# EAGLE design sc_v1 (EAGLE 9.6.2)
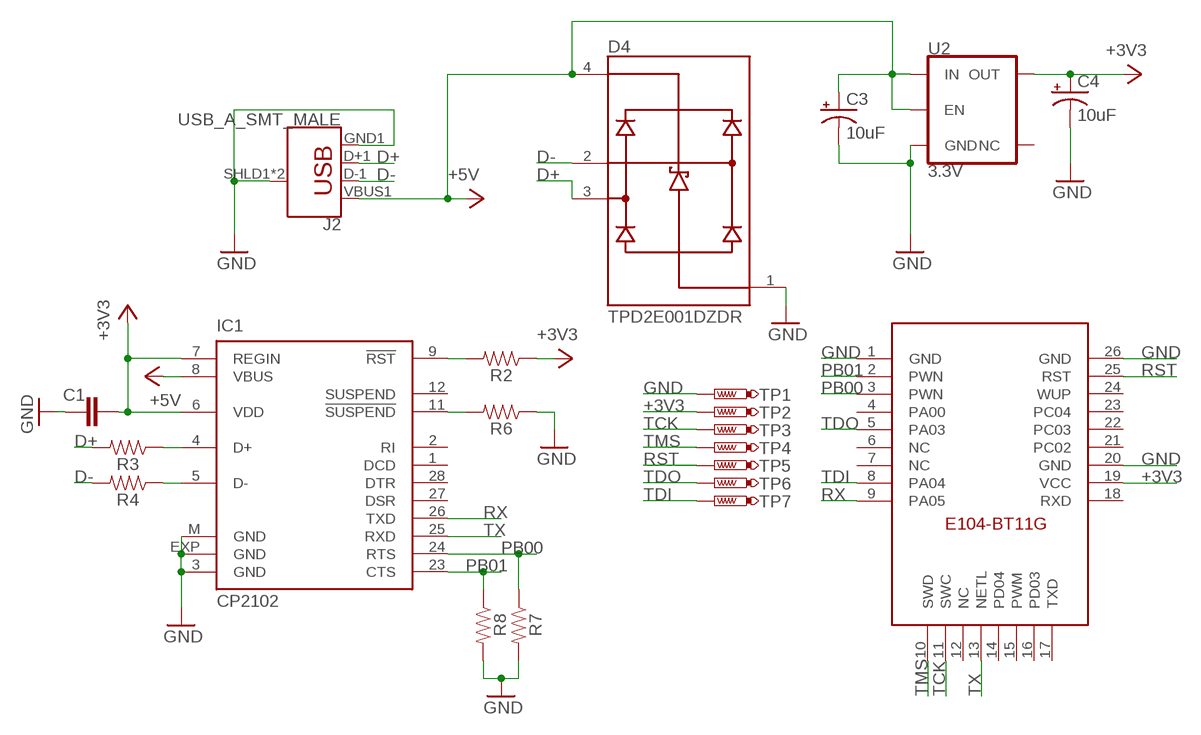
[diagram p0: schematic, sheet 1]

## Parts
C1  100nf  CAP0402  [CAPC1005X40N]
C3  10uF  10UF-POLAR-0603-6.3V-20%(TANT)  [0603-POLAR]
C4  10uF  10UF-POLAR-0603-6.3V-20%(TANT)  [0603-POLAR]
D4  TPD2E001DZDR  [SOT192P237X122-4N]
IC1  CP2102  [MLP28]
J2  USB_A_SMT_MALE  [USB-A-SMT-MALE]
R2  4.7k  RESISTOR0402  [0402]
R3  30Ohm  RESISTOR0402  [0402]
R4  30Ohm  RESISTOR0402  [0402]
R6  10k  RESISTOR0402  [0402]
R7  10k  RESISTOR0402  [0402]
R8  10k  RESISTOR0402  [0402]
TP1  PTR1TP10R  [TP10R]
TP2  PTR1TP10R  [TP10R]
TP3  PTR1TP10R  [TP10R]
TP4  PTR1TP10R  [TP10R]
TP5  PTR1TP10R  [TP10R]
TP6  PTR1TP10R  [TP10R]
TP7  PTR1TP10R  [TP10R]
U2  3.3V  V_REG_AP2112K-3.3V  [SOT23-5]
U$1  E104-BT11G-PCBPCB  [E104-BT11G-PCB]

## Nets
+3V3: C1.2 C4.+ IC1.6(VDD) IC1.7(REGIN) R2.1 TP2.TP U2.5(OUT) U$1.19(VCC)
+5V: C3.+ D4.4(VCC) IC1.8(VBUS) J2.VBUS1(VBUS) U2.1(IN) U2.3(EN)
D+: D4.3(IO2) J2.D+1(D+) R3.2
D-: D4.2(IO1) J2.D-1(D-) R4.2
GND: C1.1 C3.- C4.- D4.1(GND) IC1.3(GND) IC1.EXP(GND) IC1.M(GND) J2.GND1(GND) J2.SHLD1(SHIELD) J2.SHLD2(SHIELD) R6.1 R7.2 R8.2 TP1.TP U2.2(GND) U$1.1(GND) U$1.20(GND) U$1.26(GND)
N$1: IC1.4(D+) R3.1
N$2: IC1.5(D-) R4.1
N$3: IC1.9(!RST) R2.2
N$5: IC1.11(!SUSPEND) R6.2
PB00: IC1.24(RTS) R7.1 U$1.3(PWN)
PB01: IC1.23(CTS) R8.1 U$1.2(PWN)
RST: TP5.TP U$1.25(RST)
RX: IC1.26(TXD) U$1.9(PA05)
TCK: TP3.TP U$1.11(SWC)
TDI: TP7.TP U$1.8(PA04)
TDO: TP6.TP U$1.5(PA03)
TMS: TP4.TP U$1.10(SWD)
TX: IC1.25(RXD) U$1.13(NETL)
Unconnected: IC1.1(DCD) IC1.2(RI) IC1.12(SUSPEND) IC1.27(DSR) IC1.28(DTR) U2.4(NC) U$1.4(PA00) U$1.6(NC) U$1.7(NC) U$1.12(NC) U$1.14(PD04) U$1.15(PWM) U$1.16(PD03) U$1.17(TXD) U$1.18(RXD) U$1.21(PC02) U$1.22(PC03) U$1.23(PC04) U$1.24(WUP)

## Library data of the parts
C1 = discretes-dev:CAP0402: CAP, 0402; AVAILABILITY: Good; DESCRIPTION: RESISTOR, 0402 0.063W 1% 3M6; Resistance:3.6Mohm; Resistance Tolerance:± 1%; Power Rating:0.063W; Voltage Rating:50V; Series:RC32H; Temperature Coefficient:± 100ppm/°C; Resistor Element Type:Thick Film; Resistor Case Style:0402; No. of Pins:2; SVHC:No SVHC; Case Style:0402; External Length / Height:1mm; Temperature Coeff. +:100ppm/°C; Temperature Coeff. -:100ppm/°C; External Depth:0.35mm; External Width:0.5mm; Operating Temperature Range:-55°C to +155°C; Overload Voltage:100V; MF: Yageo; MP: RC0402FR-073M6L; PACKAGE: 1005 Panasonic Electronic Components; PRICE: None; PURCHASE-URL: https://pricing.snapeda.com/search/part/RC0402FR-073M6L/?ref=eda
C3 C4 = SparkFun-Capacitors:10UF-POLAR: 10.0µF polarized capacitors A capacitor is a passive two-terminal electrical component used to store electrical energy temporarily in an electric field.; PROD_ID: CAP-13210
D4 = TPD2E001DZDR:TPD2E001DZDR: Low-capacitance 2-channel +/-15k-V ESD protection array for high-speed data interfaces Check prices <https://pricing.snapeda.com/parts/TPD2E001DZDR/Texas%20Instruments/view-part?ref=eda>; AVAILABILITY: In Stock; DESCRIPTION: Low-capacitance 2-channel +/-15k-V ESD protection array for high-speed data interfaces 4-SOT-23 -40 to 85; MF: Texas Instruments; MP: TPD2E001DZDR; PACKAGE: SOT-23-4 Texas Instruments; PRICE: None; PURCHASE-URL: https://pricing.snapeda.com/search/part/TPD2E001DZDR/?ref=eda
IC1 = silabs:CP210*: Single-Chip USB to UART Bridge Source: www.silabs.com .. CP2101.pdf / cp2102.pdf; MF: FARNELL; MPN: CP2102-GM; OC_FARNELL: 9282130; OC_NEWARK: 30K5635
J2 = SparkFun-Connectors:USB_A: USB-A Connector Male and female variants, as well as PTH and SMT variants SparkFun Products: SparkFun XBee Explorer Dongle <https://www.sparkfun.com/products/11697> PTH Male SparkFun MicroView-USB Programmer <https://www.sparkfun.com/products/12924> SMT Male SparkFun USB Type A Female Breakout <https://www.sparkfun.com/products/12700> SMT Female; PROD_ID: CONN-11499
R2-R4 R6-R8 = SparkFun-Resistors:RESISTOR: Generic Resistor Package
TP1-TP7 = testpad:PTR1: TEST PIN
U2 = SparkFun-IC-Power:V_REG_AP2112: AP2112 - 600mA CMOS LDO Regulator w/ Enable The AP2112 is CMOS process low dropout linear regulator with enable function, the regulator delivers a guaranteed 600mA (min.) continuous load current. Features Output Voltage Accuracy: ±1.5% Output Current: 600mA (Min.) Foldback Short Current Protection: 50mA Enable Function to Turn ON/OFF VOUT Low Dropout Voltage (3.3V): 250mV (Typ.) @IOUT=600mA Excellent Load Regulation: 0.2%/A (Typ.) Excellent Line Regulation: 0.02%/V (Typ.) Low Quiescent Current: 55μA (Typ.) Low Standby Current: 0.01μA (Typ.) Low Output Noise: 50μVRMS PSRR: 100Hz -65dB, 1kHz -65dB OTSD Protection Stable with 1.0μF Flexible Cap: Ceramic, Tantalum and Aluminum Electrolytic Operation Temperature Range: -40°C to 85°C ESD: MM 400V, HBM 4000V; PROD_ID: VREG-12457
U$1 = E104-BT11G-PCB:E104-BT11G-PCB

## Board
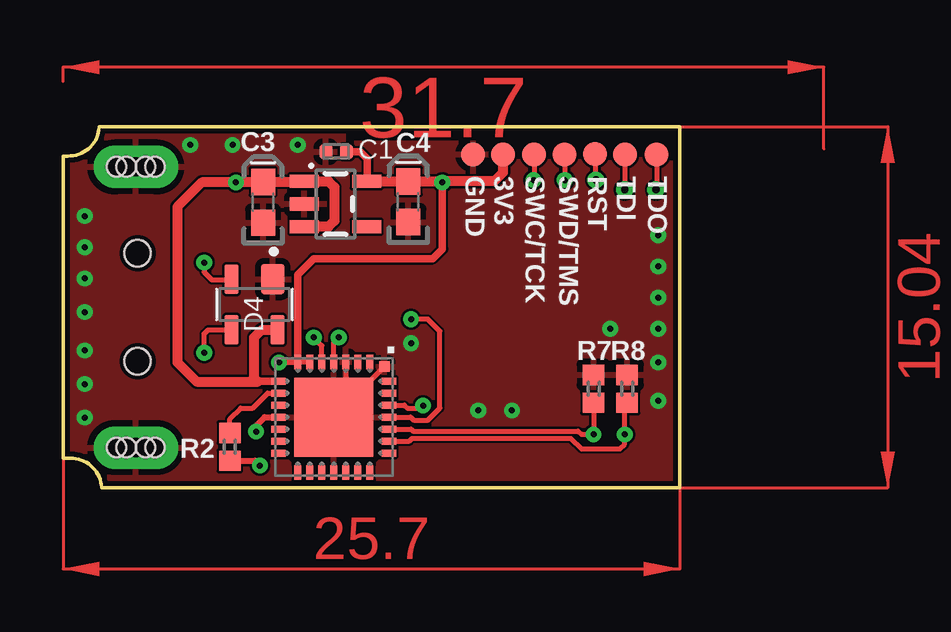
[diagram p1: board, top side]
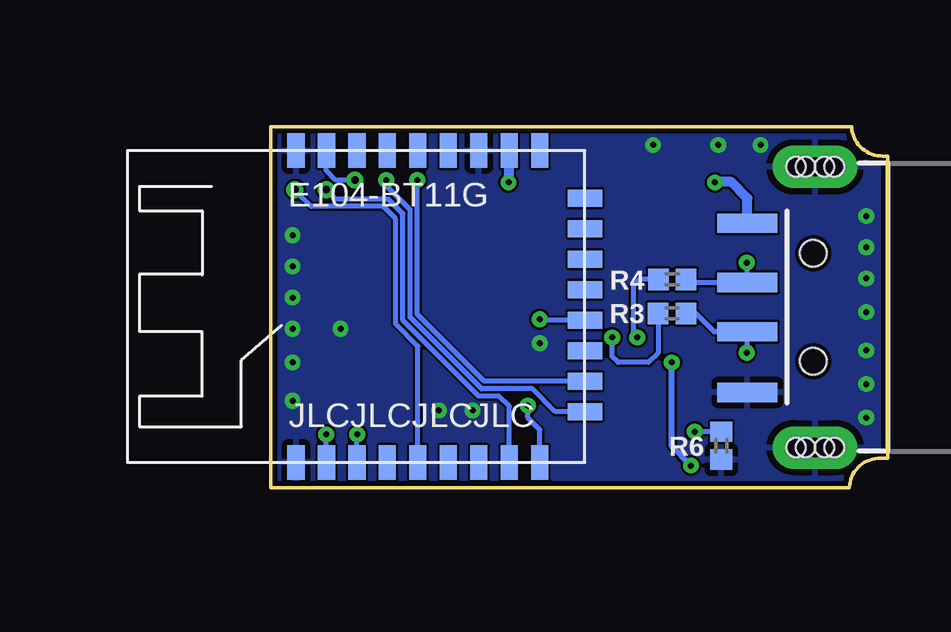
[diagram p2: board, bottom side, seen from below]

Size 25.7 x 15.04 mm. Coordinates in mm from the lower left corner, seen from the top.
Outline: 25.7,15.04 1.5,15.04 arc-90 0.2,13.82 0,13.82 0,1.22 0.3,1.22 arc-90 1.6,0 25.7,0 25.7,15.04
Copper layers (1*16): Top 0.035mm / dielectric 1.5mm / Bottom 0.035mm
Design rules "default": minimum track width 0.2mm, minimum drill 0.25mm, track to track 4mil, track to pad 4mil, pad to pad 4mil, via to via 4mil, smd to smd 4mil, copper to edge 0.2mm, drill to drill 0.25mm, minimum pad ring 10mil, minimum via ring 8mil, stop-mask expansion 2mil, vias tented up to drill 0.3mm, thermal gap 10mil

### Footprints (pad centres in the part's own frame; a part is rotated, then mirrored left to right if it is on the bottom)
CAPC1005X40N = smd 0.54 x 0.6: 1 -0.432,0; 2 0.432,0
0603-POLAR = smd 1.1 x 1: + 0.85,0; - -0.85,0
SOT192P237X122-4N = smd 1.24 x 0.99: 1 -1.055,0.76 | smd 1.24 x 0.59: 2 -1.055,-0.96; 3 1.055,-0.96; 4 1.055,0.96
MLP28 = smd 0.6 x 0.3: 1 -2.3,1.5; 2 -2.3,1; 3 -2.3,0.5; 4 -2.3,0; 5 -2.3,-0.5; 6 -2.3,-1; 7 -2.3,-1.5; 15 2.3,-1.5; 16 2.3,-1; 17 2.3,-0.5; 18 2.3,0; 19 2.3,0.5; 20 2.3,1; 21 2.3,1.5 | smd 0.3 x 0.6: 8 -1.5,-2.3; 9 -1,-2.3; 10 -0.5,-2.3; 11 0,-2.3; 12 0.5,-2.3; 13 1,-2.3; 14 1.5,-2.3; 22 1.5,2.3; 23 1,2.3; 24 0.5,2.3; 25 0,2.3; 26 -0.5,2.3; 27 -1,2.3; 28 -1.5,2.3 | smd 3.3 x 3.3: EXP 0,0 | smd 0.435 x 0.435: M -2.103,2.103
USB-A-SMT-MALE = smd 2.5 x 0.8: D+1 10.95,1.027; D-1 10.95,-1.027; GND1 10.95,3.551; VBUS1 10.95,-3.5 | drill 0.8 pad 1.778 long: SHLD1 8.13,-5.85; SHLD2 8.13,5.85 | hole 1.1: 8.2,2.25; 8.2,-2.25 | hole 0.8: 8.53,-5.85; 8.93,-5.85; 7.73,-5.85; 7.33,-5.85; 8.53,5.85; 8.93,5.85; 7.73,5.85; 7.33,5.85
0402 = smd 0.85 x 0.9: 1 -0.58,0; 2 0.58,0
TP10R = smd 1 x 1: TP 0,0
SOT23-5 = smd 0.55 x 1.2: 1 -0.95,-1.3; 2 0,-1.3; 3 0.95,-1.3; 4 0.95,1.3; 5 -0.95,1.3
E104-BT11G-PCB = smd 1.422 x 0.711: 1 -0.043,12.039; 2 -0.043,10.769; 3 -0.043,9.499; 4 -0.043,8.229; 5 -0.043,6.959; 6 -0.043,5.689; 7 -0.043,4.419; 8 -0.043,3.149; 9 -0.043,1.879; 18 12.954,1.879; 19 12.954,3.149; 20 12.954,4.419; 21 12.954,5.689; 22 12.954,6.959; 23 12.954,8.229; 24 12.954,9.499; 25 12.954,10.769; 26 12.954,12.039 | smd 0.711 x 1.422: 10 2.079,0; 11 3.349,0; 12 4.619,0; 13 5.889,0; 14 7.159,0; 15 8.429,0; 16 9.699,0; 17 10.969,0

### Placement (x,y rotation side)
C1  11.38,14 0 top
C3  8.33,11.89 90 top
C4  14.38,11.91 90 top
D4  7.97,7.64 270 top
IC1  11.28,2.94 270 top
J2  -5.1,7.52 180 bottom
R2  6.95,1.7 90 top
R3  8.99,7.26 0 bottom
R4  8.98,8.68 0 bottom
R6  6.94,1.75 90 bottom
R7  22.1,4.12 90 top
R8  23.5,4.12 90 top
TP1  17.09,13.89 0 top
TP2  18.34,13.89 0 top
TP3  19.62,13.88 0 top
TP4  20.9,13.89 0 top
TP5  22.16,13.89 0 top
TP6  24.73,13.89 0 top
TP7  23.41,13.89 0 top
U2  11.35,11.82 270 top
U$1  12.62,1.09 90 bottom

### Tracks (layer width: path | path; a pad name or v marks a point on that pad's centre or on a via)
+3V3  (via drill 0.25)
  Top 0.254: R2.1 8,1.12 v8.2,0.92 | IC1.6 IC1.7 9.76,5.22 v9,5.22
  Top 0.305: C1.2 12.38,14 12.68,13.7 12.68,12.8 U2.5 | IC1.7 9.78,8.88 10.44,9.54 15.4,9.54 15.8,9.94 v15.8,12.72
  Top 0.406: U2.5 C4.+ 15.76,12.76 v15.8,12.72 15.85,12.77 17.97,12.77 18.34,13.13 TP2.TP
  Bottom 0.254: 15.7,12.62 v15.8,12.72 | v8.2,0.92 9,1.72 v9,5.22
  Bottom 0.406: U$1.19 15.8,14.01 v15.8,12.72
+5V  (via drill 0.25)
  Top 0.254: D4.4 8.78,6.42
  Top 0.305: IC1.8 8.14,4.44 8.12,4.42
  Top 0.406: U2.3 11.05,10.87 11.3,11.12 11.3,12.52 11.05,12.77 U2.1 10.01,12.74 C3.+ 8.31,12.72 v7.2,12.72 5.78,12.72 4.76,11.7 4.76,5.22 5.56,4.42 7.8,4.42 | 7.8,4.42 8.12,4.42 | 7.8,4.42 7.96,4.58 7.96,6.26 8.28,6.58 D4.4
  Bottom 0.406: J2.VBUS1 5.85,12.07 6.52,12.74 7.18,12.74 v7.2,12.72
D+  (via drill 0.25)
  Top 0.2: v5.88,5.62 5.88,6.42 6.04,6.58 D4.3
  Bottom 0.2: v5.88,5.62 5.88,6.46 J2.D+1 7.23,6.49 8,7.26 R3.2
D-  (via drill 0.25)
  Top 0.2: v5.88,9.38 5.88,8.98 6.2,8.66 6.99,8.66 D4.2
  Bottom 0.2: v5.88,9.38 5.85,9.35 J2.D-1 8.27,8.55 R4.2
GND  (via drill 0.25)
  Top 0.2: IC1.3 11.78,3.44 | 11.78,3.44 IC1.EXP | IC1.M 11.78,3.44
  Top 0.305: 8.31,11.02 C3.- 8.3,11.07
  other vias: 22.8,6.62 24.8,10.52 17.3,3.22 18.7,3.22 14.5,6.02 0.9,11.32 0.9,10.02 0.9,8.72 0.9,7.32 0.9,5.72 0.9,4.32 0.9,2.92 24.8,9.22 24.8,7.92 24.8,6.62 24.8,5.22 24.8,3.62 5.3,14.28 7.06,14.28 9.78,14.28
  pour Bottom: -0.14,-0.18 26.09,-0.18 26.09,15.3 -0.14,15.3
  pour Top: -0.2,15.42 25.9,15.42 25.9,-0.18 -0.2,-0.18
N$1  (via drill 0.25)
  Top 0.2: IC1.4 11.28,6.06 v11.48,6.26
  Bottom 0.2: R3.1 9.57,5.61 9.96,5.22 11.24,5.22 11.48,5.46 v11.48,6.26
N$2  (via drill 0.25)
  Top 0.2: IC1.5 10.78,5.92 v10.44,6.26
  Bottom 0.2: R4.1 10.35,8.68 10.6,8.42 10.6,6.42 v10.44,6.26
N$3
  Top 0.2: R2.2 6.95,2.87 7.4,3.32 7.9,3.32 8.52,3.94 IC1.9
N$5  (via drill 0.25)
  Top 0.254: v8.04,2.34 8.04,2.58 8.4,2.94 IC1.11
  Bottom 0.2: R6.2 v8.04,2.34
PB00  (via drill 0.25)
  Top 0.2: 13.63,2.39 IC1.24 14.5,2.44 14.58,2.36 21.46,2.36 21.6,2.22 v22.1,2.22 R7.1
  Bottom 0.2: U$1.3 22.12,2.2 v22.1,2.22
PB01  (via drill 0.25)
  Top 0.2: R8.1 23.4,3.44 v23.4,2.22 23.4,1.82 23.2,1.62 21.6,1.62 21.16,2.06 14.54,2.06 14.42,1.94 IC1.23
  Bottom 0.2: U$1.2 23.39,2.21 v23.4,2.22
RST  (via drill 0.3)
  Top 0.2: TP5.TP 22.16,12.86 v22.2,12.82
  Bottom 0.2: v22.2,12.82 23,12.82 23.4,13.22 23.4,14.03 U$1.25
RX  (via drill 0.25)
  Top 0.2: IC1.26 14.22,3.44 14.36,3.3 14.88,3.3 v15,3.42
  Bottom 0.2: U$1.9 14.5,2.42 15,2.92 v15,3.42
TCK  (via drill 0.25)
  Top 0.2: TP3.TP 19.62,12.84 v19.6,12.82
  Bottom 0.2: U$1.11 16.82,4.44 19.6,7.22 v19.6,12.82
TDI  (via drill 0.3)
  Top 0.2: TP7.TP v23.41,12.43 v23.4,12.42
  Bottom 0.2: U$1.8 15.77,3.38 16.2,3.82 17.05,3.82 20.2,6.97 20.2,11.42 20.8,12.02 23,12.02 v23.4,12.42
TDO  (via drill 0.3)
  Top 0.2: TP6.TP 24.73,12.42 v24.7,12.42
  Bottom 0.2: U$1.5 19.58,5.9 20.51,6.83 20.51,11.2 21.03,11.72 24.02,11.72 24.7,12.39 v24.7,12.42
TMS  (via drill 0.25)
  Top 0.2: TP4.TP v20.9,12.82
  Bottom 0.2: U$1.10 13.85,3.17 14.8,4.12 16.93,4.12 19.9,7.09 19.9,11.58 20.9,12.58 v20.9,12.82
TX  (via drill 0.25)
  Top 0.2: v14.5,7.02 15.2,7.02 15.7,6.52 15.7,3.32 15.2,2.82 14.6,2.82 14.48,2.94 IC1.25
  Bottom 0.2: U$1.13 14.46,6.98 v14.5,7.02
(copper drawn outside any net)
  shapes: Top area x3

### Text on the board
tNames: C3 | C4 | GND | 3V3 | SWC/TCK | SWD/TMS | RST | TDI | TDO | .
bNames: E104-BT11G | JLCJLCJLCJLC